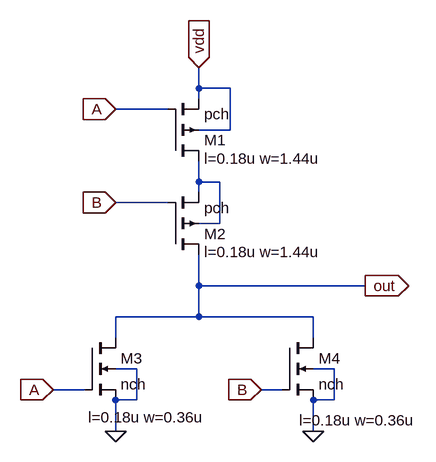
[diagram p0: schematic nor_sym.asc]
nor_sym.asc, the LTspice schematic file:
Version 4
SHEET 1 880 680
WIRE 224 -336 224 -368
WIRE 272 -336 224 -336
WIRE 224 -320 224 -336
WIRE 176 -304 96 -304
WIRE 272 -272 272 -336
WIRE 272 -272 224 -272
WIRE 224 -192 224 -224
WIRE 256 -192 224 -192
WIRE 224 -176 224 -192
WIRE 176 -160 96 -160
WIRE 256 -128 256 -192
WIRE 256 -128 224 -128
WIRE 224 -32 224 -80
WIRE 480 -32 224 -32
WIRE 224 16 224 -32
WIRE 224 16 96 16
WIRE 400 16 224 16
WIRE 96 48 96 16
WIRE 400 48 400 16
WIRE 128 96 96 96
WIRE 432 96 400 96
WIRE 48 128 0 128
WIRE 352 128 320 128
WIRE 128 144 128 96
WIRE 128 144 96 144
WIRE 432 144 432 96
WIRE 432 144 400 144
WIRE 96 192 96 144
WIRE 400 192 400 144
FLAG 96 192 0
FLAG 400 192 0
FLAG 224 -368 vdd
IOPIN 224 -368 In
FLAG 96 -304 A
IOPIN 96 -304 In
FLAG 96 -160 B
IOPIN 96 -160 In
FLAG 480 -32 out
IOPIN 480 -32 Out
FLAG 0 128 A
IOPIN 0 128 In
FLAG 320 128 B
IOPIN 320 128 In
SYMBOL pmos4 176 -224 M180
WINDOW 123 56 4 Left 2
SYMATTR InstName M1
SYMATTR Value pch
SYMATTR Value2 l=0.18u w=1.44u
SYMBOL pmos4 176 -80 M180
WINDOW 123 56 4 Left 2
SYMATTR InstName M2
SYMATTR Value pch
SYMATTR Value2 l=0.18u w=1.44u
SYMBOL nmos4 48 48 R0
WINDOW 123 6 123 Left 2
SYMATTR InstName M3
SYMATTR Value nch
SYMATTR Value2 l=0.18u w=0.36u
SYMBOL nmos4 352 48 R0
WINDOW 123 26 127 Left 2
SYMATTR InstName M4
SYMATTR Value nch
SYMATTR Value2 l=0.18u w=0.36u

The netlist it stands for:
* nor_sym.asc
M1 N001 A vdd vdd pch l=0.18u w=1.44u
M2 out B N001 N001 pch l=0.18u w=1.44u
M3 out A 0 0 nch l=0.18u w=0.36u
M4 out B 0 0 nch l=0.18u w=0.36u
.model NMOS NMOS
.model PMOS PMOS
.lib standard.mos
.backanno
.end